# Altium schematic sheet hardware.SchDoc
size A4; Author: 卡文迪许怪; CompanyName: 卡文迪许实验室; Revision: V1.0; SheetNumber: 1; SheetTotal: 1
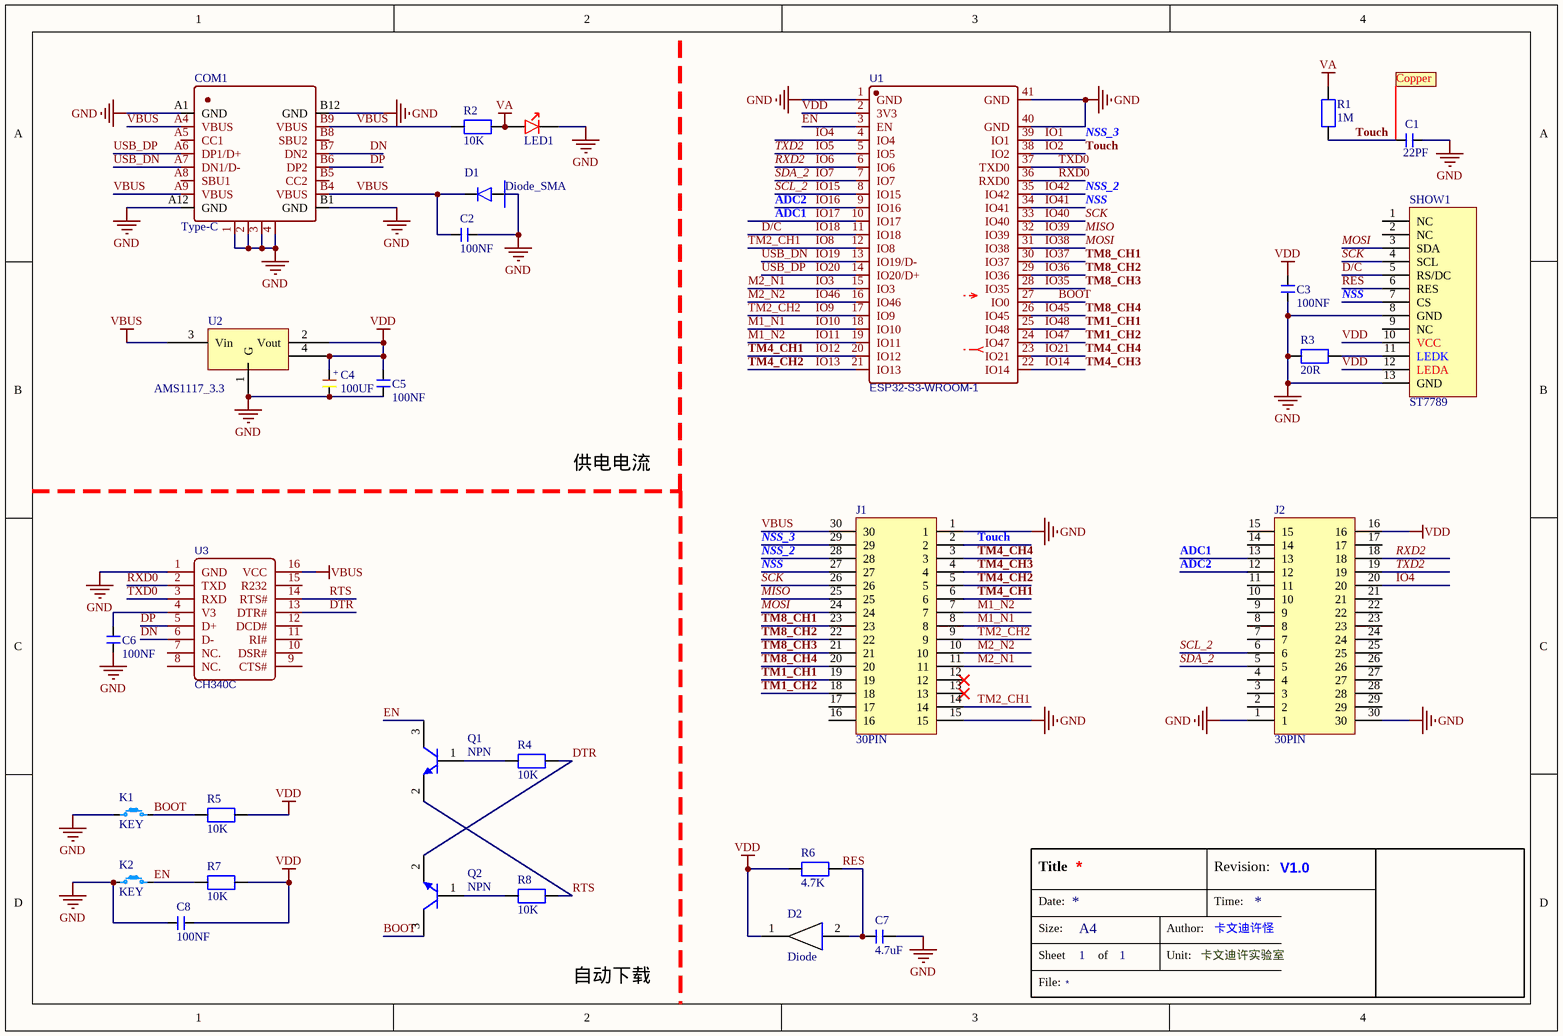
[diagram p0: hardware.SchDoc]

## Parts
C1  22PF  [CAP_0603]
C2  100NF  [CAP_0603]
C3  100NF  [CAP_0603]
C4  100UF  [CAP_3528_B]
C5  100NF  [CAP_0603]
C6  100NF  [CAP_0603]
C7  4.7uF  [CAP_0603]
C8  100NF  [CAP_0603]
COM1  Type-C  [USB-Type-C_16A]
D1  Diode_SMA  [DIODE_SOD123]
D2  Diode  [SOD123]
J1  30PIN  [BTB_Double_30Pin_Up]
J2  30PIN  [BTB_Double_30Pin_Up]
K1  KEY  [SW_PB_3X6]
K2  KEY  [SW_PB_3X6]
LED1  LED_R/G/B/Y  [LED_0603_R]  (value not drawn)
Q1  NPN  [SOT23_3]
Q2  NPN  [SOT23_3]
R1  1M  [RESC_0603_2]
R2  10K  [RESC_0603_2]
R3  20R  [RESC_0603_2]
R4  10K  [RESC_0603_2]
R5  10K  [RESC_0603_2]
R6  4.7K  [RESC_0603_2]
R7  10K  [RESC_0603_2]
R8  10K  [RESC_0603_2]
SHOW1  ST7789  [LCD_1.14]
U1  ESP32-S3-WROOM-1  [ESP32-S3-WROOM-1]
U2  AMS1117_3.3  [SOT223_3]
U3  CH340C  [SOIC_16]

## Nets
GND: C1.2 C2.1 C3.2 C4.2 C5.2 C6.2 C7.1 C8.2 COM1.1 COM1.2 COM1.3 COM1.4 COM1.A1(GND) COM1.A12(GND) COM1.B1(GND) COM1.B12(GND) D1.1(P) J1.1 J1.15 J2.1 J2.30 K1.2 K2.2 LED1.1(-) R3.1 SHOW1.8(GND) SHOW1.13(GND) U1.1(GND) U1.40(GND) U1.41(GND) U2.1(G) U3.1(GND)
VA: LED1.2(+) R1.2 R2.2
VBUS: C2.2 COM1.A4(VBUS) COM1.A9(VBUS) COM1.B4(VBUS) COM1.B9(VBUS) D1.2(N) J1.30 R2.1 U2.3(Vin) U3.16(VCC)
VDD: C3.1 C4.1 C5.1 C8.1 D2.1(N) J2.16 R5.2 R6.1 R7.2 SHOW1.10(VCC) SHOW1.12(LEDA) U1.2(3V3) U2.2(Vout) U2.4(Vout)
ADC1: J2.13 U1.10(IO17)  [also labelled IO17]
ADC2: J2.12 U1.9(IO16)  [also labelled IO16]
BOOT: K1.1 Q2.3(C) R5.1 U1.27(IO0)
D/C: SHOW1.5(RS/DC) U1.11(IO18)  [also labelled IO18]
DN: COM1.B7(DN2) U3.6(D-)
DP: COM1.B6(DP2) U3.5(D+)
DTR: Q2.2(E) R4.2 U3.13(DTR#)
EN: K2.1 Q1.3(C) R7.1 U1.3(EN)
IO1: J1.29 U1.39(IO1)  [also labelled NSS_3]
IO2: C1.1 J1.2 R1.1 U1.38(IO2)  [also labelled Touch]
IO3: J1.11 U1.15(IO3)  [also labelled M2_N1]
IO4: J2.20 U1.4(IO4)
IO5: J2.19 U1.5(IO5)  [also labelled TXD2]
IO6: J2.18 U1.6(IO6)  [also labelled RXD2]
IO7: J2.5 U1.7(IO7)  [also labelled SDA_2]
IO8: J1.14 U1.12(IO8)  [also labelled TM2_CH1]
IO9: J1.9 U1.17(IO9)  [also labelled TM2_CH2]
IO10: J1.8 U1.18(IO10)  [also labelled M1_N1]
IO11: J1.7 U1.19(IO11)  [also labelled M1_N2]
IO12: J1.6 U1.20(IO12)  [also labelled TM4_CH1]
IO13: J1.5 U1.21(IO13)  [also labelled TM4_CH2]
IO14: J1.4 U1.22(IO14)  [also labelled TM4_CH3]
IO15: J2.6 U1.8(IO15)  [also labelled SCL_2]
IO19: COM1.A7(DN1/D-) U1.13(IO19/D-)  [also labelled USB_DN]
IO20: COM1.A6(DP1/D+) U1.14(IO20/D+)  [also labelled USB_DP]
IO21: J1.3 U1.23(IO21)  [also labelled TM4_CH4]
IO35: J1.21 U1.28(IO35)  [also labelled TM8_CH3]
IO36: J1.22 U1.29(IO36)  [also labelled TM8_CH2]
IO37: J1.23 U1.30(IO37)  [also labelled TM8_CH1]
IO38: J1.24 SHOW1.3(SDA) U1.31(IO38)  [also labelled MOSI]
IO39: J1.25 U1.32(IO39)  [also labelled MISO]
IO40: J1.26 SHOW1.4(SCL) U1.33(IO40)  [also labelled SCK]
IO41: J1.27 SHOW1.7(CS) U1.34(IO41)  [also labelled NSS]
IO42: J1.28 U1.35(IO42)  [also labelled NSS_2]
IO45: J1.20 U1.26(IO45)  [also labelled TM8_CH4]
IO46: J1.10 U1.16(IO46)  [also labelled M2_N2]
IO47: J1.18 U1.24(IO47)  [also labelled TM1_CH2]
IO48: J1.19 U1.25(IO48)  [also labelled TM1_CH1]
RES: C7.2 D2.2(P) R6.2 SHOW1.6(RES)
RTS: Q1.2(E) R8.2 U3.14(RTS#)
RXD0: U1.36(RXD0) U3.2(TXD)
TXD0: U1.37(TXD0) U3.3(RXD)
NetC6_1: C6.1 U3.4(V3)
NetQ1_1: Q1.1(B) R4.1
NetQ2_1: Q2.1(B) R8.1
NetR3_2: R3.2 SHOW1.11(LEDK)

Not connected (* = marked no-connect by the designer): COM1 A5(CC1) A8(SBU1) B5(CC2) B8(SBU2); J1 12* 13* 16 17; J2 2 3 4 7 8 9 10 11 14 15 17 21 22 23 24 25 26 27 28 29; SHOW1 1(NC) 2(NC) 9(NC); U3 7(NC.) 8(NC.) 9(CTS#) 10(DSR#) 11(RI#) 12(DCD#) 15(R232)

## Notes on the sheet
- Copper
- 供电电流
- 自动下载
- Title
- Date:
- Revision:
- Time:
- File:
- Size:
- Sheet
- A4
- of
- Author:
- Unit:
- (in symbol CAP_TA) +

## Library data of the parts
C1-C3 C5 C6 C8 = CAP: CAP  12~50V
C4 = CAP_TA: CAP  6~12V  钽电容
C7 = CAP_SDM: CAP
COM1 = USB-type_c: USB
D1 = Diode-SM: Diode_肖特基
D2 = Diode-SOD: 开关二极管
J1 J2 = BTB_DOUBLE_30PIN
LED1 = LED
R1-R8 = RES_S: RES 贴片
SHOW1 = LCD_1.14: SHOW
U1 = ESP32-S3-WROOM-1: BOM_Manufacturer: Espressif Systems; BOM_Manufacturer Part: ESP32-SOLO-1; Contributor: LCSC; BOM_Supplier: LCSC; BOM_Supplier Part: C473005; BOM_JLCPCB Part Class: Extended Part; spicePre: U; spiceSymbolName: ESP32-S3-WROOM-1
U2 = AMS1117_3.3: DC-DC
U3 = CH340C: BOM_Manufacturer: WCH; BOM_Paste Type: recommend; BOM_Supplier: LCSC; BOM_Manufacturer Part: CH340C; BOM_Supplier Part: C84681; spicePre: U; spiceSymbolName: CH340C